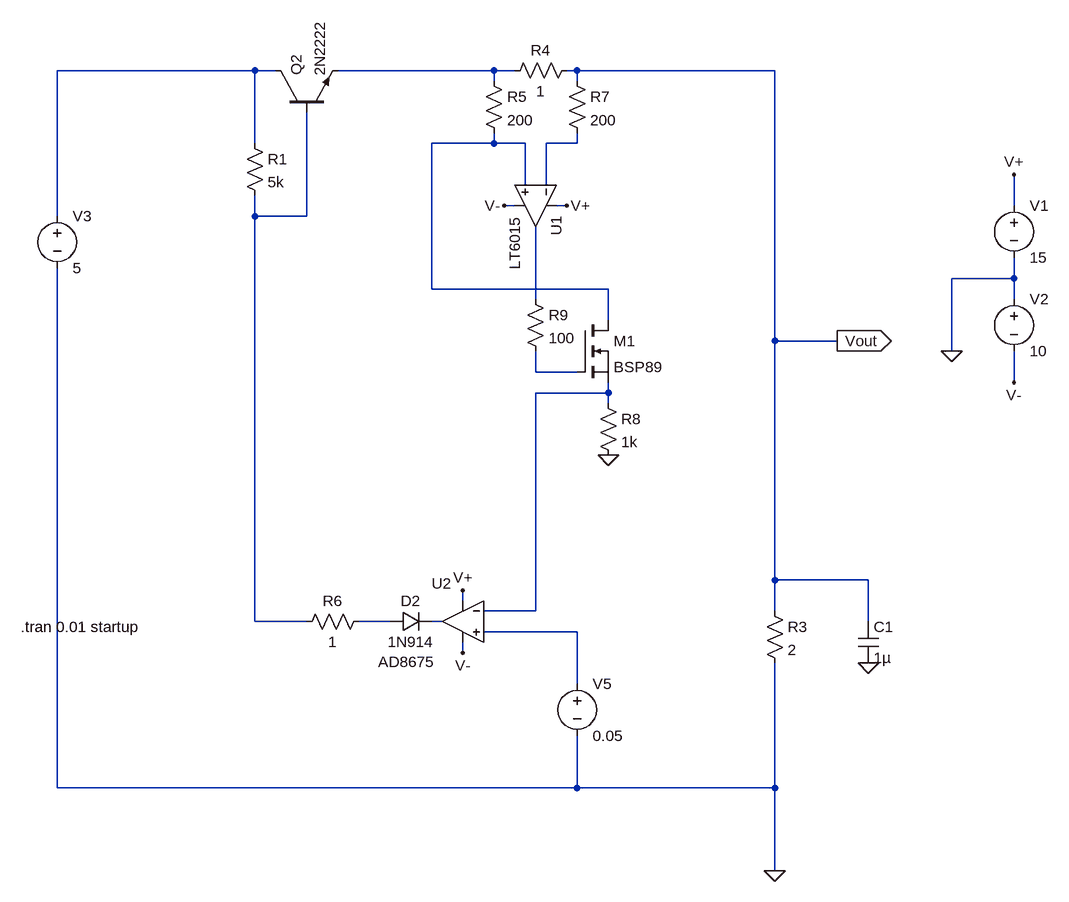
[diagram p0: schematic high_side_current_sense_2.asc]
high_side_current_sense_2.asc, the LTspice schematic file:
Version 4
SHEET 1 1552 1284
WIRE -224 32 -528 32
WIRE -192 32 -224 32
WIRE 144 32 -96 32
WIRE 176 32 144 32
WIRE 272 32 256 32
WIRE 576 32 272 32
WIRE 144 48 144 32
WIRE 272 48 272 32
WIRE -224 144 -224 32
WIRE 144 144 144 128
WIRE 144 144 48 144
WIRE 192 144 144 144
WIRE 272 144 272 128
WIRE 272 144 224 144
WIRE 192 208 192 144
WIRE 224 208 224 144
WIRE 176 240 160 240
WIRE 256 240 240 240
WIRE 944 240 944 192
WIRE -528 256 -528 32
WIRE -224 256 -224 224
WIRE -144 256 -144 96
WIRE -144 256 -224 256
WIRE 944 352 944 320
WIRE 944 352 848 352
WIRE 48 368 48 144
WIRE 320 368 48 368
WIRE 208 384 208 272
WIRE 944 384 944 352
WIRE 320 416 320 368
WIRE 576 448 576 32
WIRE 672 448 576 448
WIRE 848 464 848 352
WIRE 208 496 208 464
WIRE 272 496 208 496
WIRE 944 512 944 464
WIRE 320 528 320 512
WIRE 320 528 208 528
WIRE 320 544 320 528
WIRE 576 816 576 448
WIRE 720 816 576 816
WIRE 96 848 96 832
WIRE 208 864 208 528
WIRE 208 864 128 864
WIRE 576 864 576 816
WIRE -224 880 -224 256
WIRE -144 880 -224 880
WIRE -16 880 -64 880
WIRE 64 880 48 880
WIRE 720 880 720 816
WIRE 272 896 128 896
WIRE 96 928 96 912
WIRE 272 976 272 896
WIRE -528 1136 -528 336
WIRE 272 1136 272 1056
WIRE 272 1136 -528 1136
WIRE 576 1136 576 944
WIRE 576 1136 272 1136
WIRE 576 1264 576 1136
FLAG 944 192 V+
FLAG 944 512 V-
FLAG 672 448 Vout
IOPIN 672 448 Out
FLAG 576 1264 0
FLAG 848 464 0
FLAG 96 832 V+
FLAG 96 928 V-
FLAG 256 240 V+
FLAG 160 240 V-
FLAG 320 624 0
FLAG 720 944 0
SYMBOL voltage 944 224 R0
WINDOW 123 0 0 Left 0
WINDOW 39 0 0 Left 0
SYMATTR InstName V1
SYMATTR Value 15
SYMBOL voltage 944 368 R0
WINDOW 123 0 0 Left 0
WINDOW 39 0 0 Left 0
SYMATTR InstName V2
SYMATTR Value 10
SYMBOL voltage -528 240 R0
WINDOW 123 0 0 Left 0
WINDOW 39 0 0 Left 0
SYMATTR InstName V3
SYMATTR Value 5
SYMBOL npn -192 96 R270
SYMATTR InstName Q2
SYMATTR Value 2N2222
SYMBOL Opamps\\AD8675 96 816 M0
WINDOW 0 17 5 Left 2
WINDOW 3 43 126 Left 2
SYMATTR InstName U2
SYMBOL diode -16 896 R270
WINDOW 0 32 32 VTop 2
WINDOW 3 0 32 VBottom 2
SYMATTR InstName D2
SYMATTR Value 1N914
SYMBOL voltage 272 960 R0
WINDOW 123 0 0 Left 0
WINDOW 39 0 0 Left 0
SYMATTR InstName V5
SYMATTR Value 0.05
SYMBOL res 560 848 R0
SYMATTR InstName R3
SYMATTR Value 2
SYMBOL res -48 864 R90
WINDOW 0 0 56 VBottom 2
WINDOW 3 32 56 VTop 2
SYMATTR InstName R6
SYMATTR Value 1
SYMBOL res -240 128 R0
SYMATTR InstName R1
SYMATTR Value 5k
SYMBOL res 160 48 R270
WINDOW 0 32 56 VTop 2
WINDOW 3 0 56 VBottom 2
SYMATTR InstName R4
SYMATTR Value 1
SYMBOL Opamps\\LT6015 208 240 R90
SYMATTR InstName U1
SYMBOL res 128 32 R0
SYMATTR InstName R5
SYMATTR Value 200
SYMBOL res 256 32 R0
SYMATTR InstName R7
SYMATTR Value 200
SYMBOL nmos 272 416 R0
SYMATTR InstName M1
SYMATTR Value BSP89
SYMBOL res 304 528 R0
SYMATTR InstName R8
SYMATTR Value 1k
SYMBOL res 192 368 R0
SYMATTR InstName R9
SYMATTR Value 100
SYMBOL cap 704 880 R0
SYMATTR InstName C1
SYMATTR Value 1µ
TEXT -584 888 Left 2 !.tran 0.01 startup

The netlist it stands for:
* high_side_current_sense_2.asc
V1 V+ 0 15
V2 0 V- 10
V3 N001 0 5
Q2 N001 N005 N002 0 2N2222
XU2 N011 N008 V+ V- N010 AD8675  ; pins In+ In- V+ V- OUT
D2 N009 N010 1N914
V5 N011 0 0.05
R3 Vout 0 2
R6 N009 N005 1
R1 N001 N005 5k
R4 N002 Vout 1
XU1 N003 N004 V+ V- N006 LT6016  ; LT6015, pins In+ In- V+ V- OUT
R5 N002 N003 200
R7 Vout N004 200
M1 N003 N007 N008 N008 BSP89
R8 N008 0 1k
R9 N006 N007 100
C1 Vout 0 1µ
.model D D
.lib standard.dio
.model NPN NPN
.model PNP PNP
.lib standard.bjt
.model NMOS NMOS
.model PMOS PMOS
.lib standard.mos
.tran 0.01 startup
.lib LTC2.lib
.backanno
.end